# EAGLE design main (EAGLE 7.3.0)
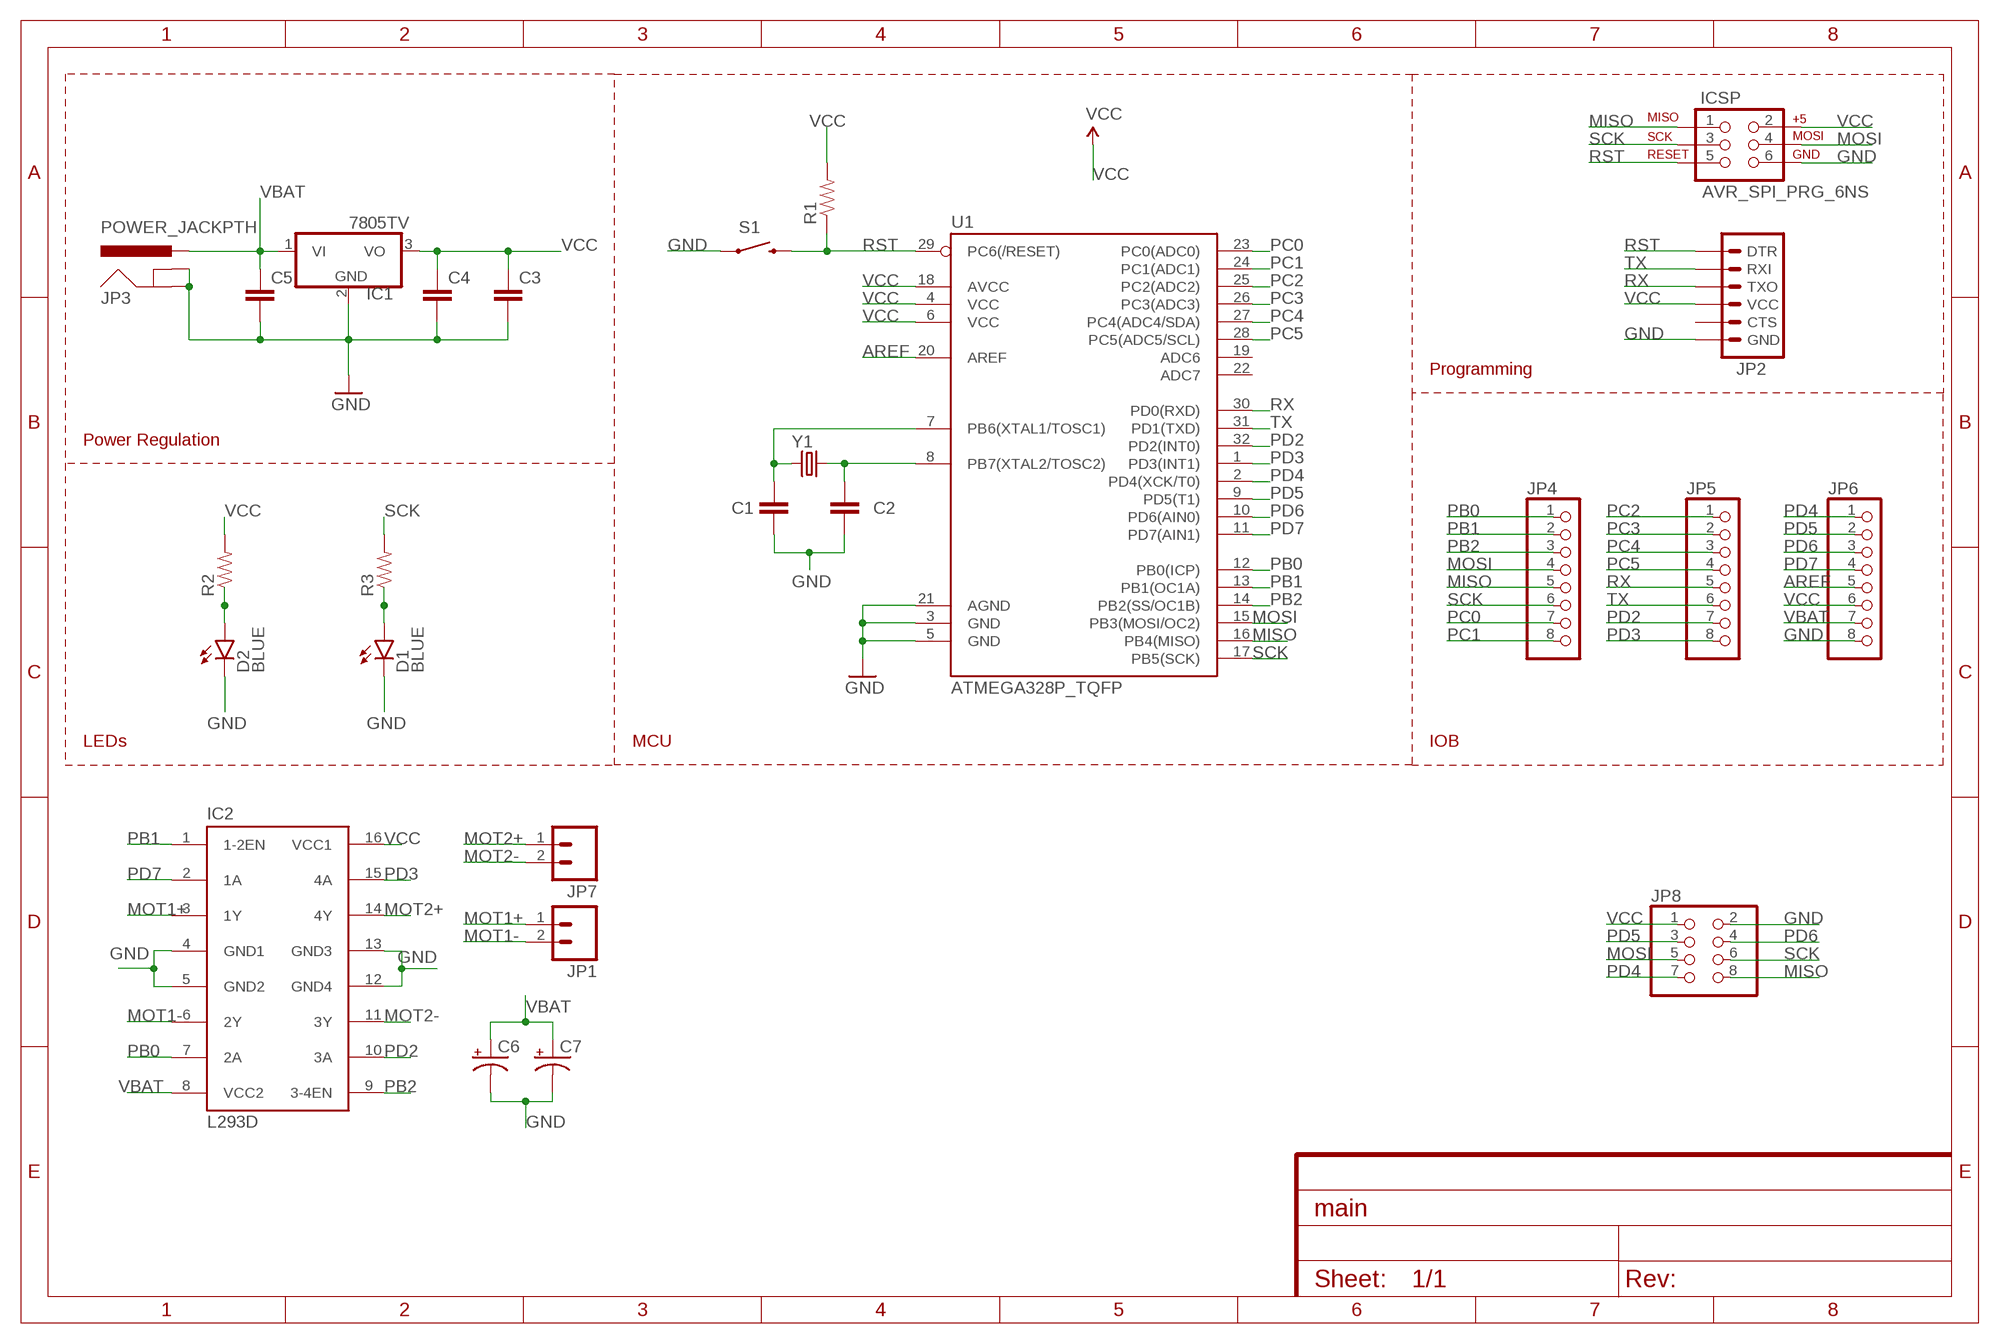
[diagram p0: schematic, sheet 1]

## Parts
C1  CAP0805  [0805]
C2  CAP0805  [0805]
C3  CAP0805  [0805]
C4  CAP0805  [0805]
C5  CAP0805  [0805]
C6  CAP_POLPTH2  [CPOL-RADIAL-10UF-25V]
C7  CAP_POLPTH2  [CPOL-RADIAL-10UF-25V]
D1  BLUE  LED-BLUE0603  [LED-0603]
D2  BLUE  LED-BLUE0603  [LED-0603]
IC1  7805TV  [TO220V]
IC2  L293D  [DIL16]
ICSP  AVR_SPI_PRG_6NS  [2X3-NS]
JP1  M025MM  [SCREWTERMINAL-5MM-2]
JP2  ARDUINO_SERIAL_PROGRAMLOCK  [1X06_LOCK]
JP3  POWER_JACKPTH  [POWER_JACK_PTH]
JP4  PINHD-1X8  [1X08]
JP5  PINHD-1X8  [1X08]
JP6  PINHD-1X8  [1X08]
JP7  M025MM  [SCREWTERMINAL-5MM-2]
JP8  PINHD-2X4  [2X04]
R1  RESISTOR0805-RES  [0805]
R2  RESISTOR0805-RES  [0805]
R3  RESISTOR0805-RES  [0805]
S1  SWITCH-MOMENTARY-2SMD  [TACTILE-SWITCH-SMD]
U1  ATMEGA328P_TQFP  [TQFP32-08]
Y1  CRYSTALHC49US  [HC49US]

## Nets
AREF: JP6.5 U1.20(AREF)
GND [GND]: C1.2 C2.2 C3.2 C4.2 C5.2 C6.2(-) C7.2(-) D1.C D2.C IC1.2(GND) IC2.4(GND1) IC2.5(GND2) IC2.12(GND4) IC2.13(GND3) ICSP.6 JP2.6(GND) JP3.GND JP3.GNDBREAK JP6.8 JP8.2 S1.1 U1.3(GND) U1.5(GND) U1.21(AGND)
MISO: ICSP.1 JP4.5 JP8.8 U1.16(PB4(MISO))
MOSI: ICSP.4 JP4.4 JP8.5 U1.15(PB3(MOSI/OC2))
MOT1+: IC2.3(1Y) JP1.1
MOT1-: IC2.6(2Y) JP1.2
MOT2+: IC2.14(4Y) JP7.1
MOT2-: IC2.11(3Y) JP7.2
N$1: C1.1 U1.7(PB6(XTAL1/TOSC1)) Y1.2
N$2: C2.1 U1.8(PB7(XTAL2/TOSC2)) Y1.1
N$3: D2.A R2.1
N$4: D1.A R3.1
PB0: IC2.7(2A) JP4.1 U1.12(PB0(ICP))
PB1: IC2.1(1-2EN) JP4.2 U1.13(PB1(OC1A))
PB2: IC2.9(3-4EN) JP4.3 U1.14(PB2(SS/OC1B))
PC0: JP4.7 U1.23(PC0(ADC0))
PC1: JP4.8 U1.24(PC1(ADC1))
PC2: JP5.1 U1.25(PC2(ADC2))
PC3: JP5.2 U1.26(PC3(ADC3))
PC4: JP5.3 U1.27(PC4(ADC4/SDA))
PC5: JP5.4 U1.28(PC5(ADC5/SCL))
PD2: IC2.10(3A) JP5.7 U1.32(PD2(INT0))
PD3: IC2.15(4A) JP5.8 U1.1(PD3(INT1))
PD4: JP6.1 JP8.7 U1.2(PD4(XCK/T0))
PD5: JP6.2 JP8.3 U1.9(PD5(T1))
PD6: JP6.3 JP8.4 U1.10(PD6(AIN0))
PD7: IC2.2(1A) JP6.4 U1.11(PD7(AIN1))
RST: ICSP.5 JP2.1(DTR) R1.1 S1.3 U1.29(PC6(/RESET))
RX: JP2.3(TXO) JP5.5 U1.30(PD0(RXD))
SCK: ICSP.3 JP4.6 JP8.6 R3.2 U1.17(PB5(SCK))
TX: JP2.2(RXI) JP5.6 U1.31(PD1(TXD))
VBAT [VBAT]: C5.1 C6.1(+) C7.1(+) IC1.1(VI) IC2.8(VCC2) JP3.PWR JP6.7
VCC [VCC]: C3.1 C4.1 IC1.3(VO) IC2.16(VCC1) ICSP.2 JP2.4(VCC) JP6.6 JP8.1 R1.2 R2.2 U1.4(VCC) U1.6(VCC) U1.18(AVCC)
Unconnected: JP2.5(CTS) U1.19(ADC6) U1.22(ADC7)

## Notes on the sheet
- Programming
- Power Regulation
- LEDs | MCU | IOB

## Library data of the parts
C1-C5 = SparkFun-Passives:CAP: Capacitor Standard 0603 ceramic capacitor, and 0.1" leaded capacitor.
C6 C7 = SparkFun-Passives:CAP_POL: Capacitor Polarized These are standard SMD and PTH capacitors. Normally 10uF, 47uF, and 100uF in electrolytic and tantalum varieties. Always verify the external diameter of the through hole cap, it varies with capacity, voltage, and manufacturer. The EIA devices should be standard.
D1 D2 = SparkFun-LED:LED-BLUE: Blue LEDs for production use Various blue LEDs stocked by SparkFun production 0603 - DIO-08575 Rebel - DIO-09553 1206 - DIO-09911; PROD_ID: DIO-08575
IC1 = linear:78*: Positive VOLTAGE REGULATOR Source: http://cache.national.com/ds/LM/LM78L05.pdf http://www.fairchildsemi.com/ds/LM/LM7805.pdf
IC2 = st-microelectronics:L293D: PUSH-PULL 4 CHANNEL DRIVER; MPN: L293D; OC_FARNELL: 9589619; OC_NEWARK: 56P8249
ICSP = SparkFun-Connectors:AVR_SPI_PRG_6: AVR ISP 6 Pin This is the reduced ISP connector for AVR programming. Common on Arduino. This footprint will take up less PCB space and can be used with a 10-pin to 6-pin adapter such as SKU: BOB-08508 **Special note about "TEST_POINT" package. The stop mask is on the top side, so if you want your programming test points to be on the bottom of your board, make sure to place this package on the bottom side of the board. This also ensure that the orientation to program from the bottom side will be correct.
JP1 JP7 = SparkFun-Connectors:M02: Standard 2-pin 0.1" header. Use with - straight break away headers ( PRT-00116) - right angle break away headers (PRT-00553) - swiss pins (PRT-00743) - machine pins (PRT-00117) - female headers (PRT-00115) Molex polarized connector foot print use with: PRT-08233 with associated crimp pins and housings. 2.54_SCREWTERM for use with PRT-10571. 3.5mm Screw Terminal footprints for PRT-08084 5mm Screw Terminal footprints for use with PRT-08432; STOREFRONT_ID: PRT-08432
JP2 = SparkFun-Connectors:ARDUINO_SERIAL_PROGRAM: FTDI connector footprints
JP3 = SparkFun-Connectors:POWER_JACK: Power Jack This is the standard 5.5mm barrel jack for power. The PTH is the most common, proven, reliable, footprint. The Slot footprint only works if the mill layer is transmitted to the PCB fab house so be warned. Mating wall wart : TOL-00298 (and others); PROD_ID: CONN-08197
JP4-JP6 = pinhead:PINHD-1X8: PIN HEADER
JP8 = pinhead:PINHD-2X4: PIN HEADER
R1-R3 = SparkFun-Resistors:RESISTOR: Resistor Basic schematic elements and footprints for 0603, 1206, and PTH resistors.
S1 = SparkFun-Electromechanical:SWITCH-MOMENTARY-2: Various NO switches- pushbuttons, reed, etc; PROD_ID: SWCH-08247
U1 = SparkFun-DigitalIC:ATMEGA328P_TQFP; PROD_ID: IC-09069
Y1 = SparkFun-FreqCtrl:CRYSTAL: Various standard crystals. Proven footprints.

## Net classes
1 GND: width 0.254 mm
2 VBAT: width 0.254 mm
3 VCC: width 0.254 mm

## Board
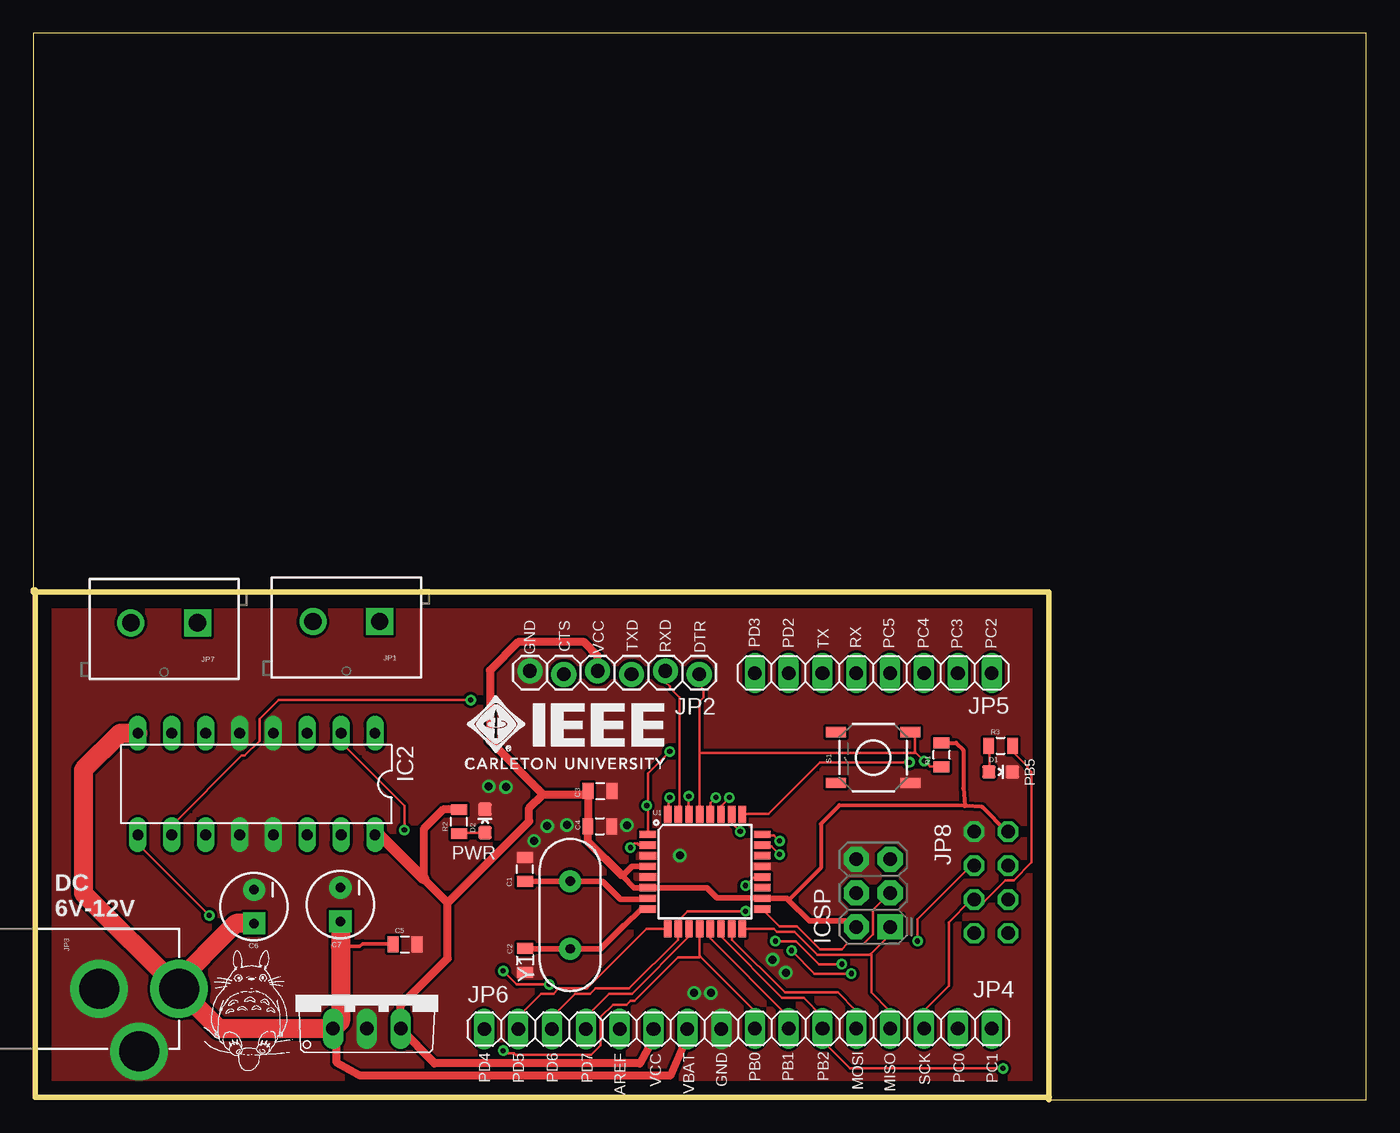
[diagram p1: board, top side]
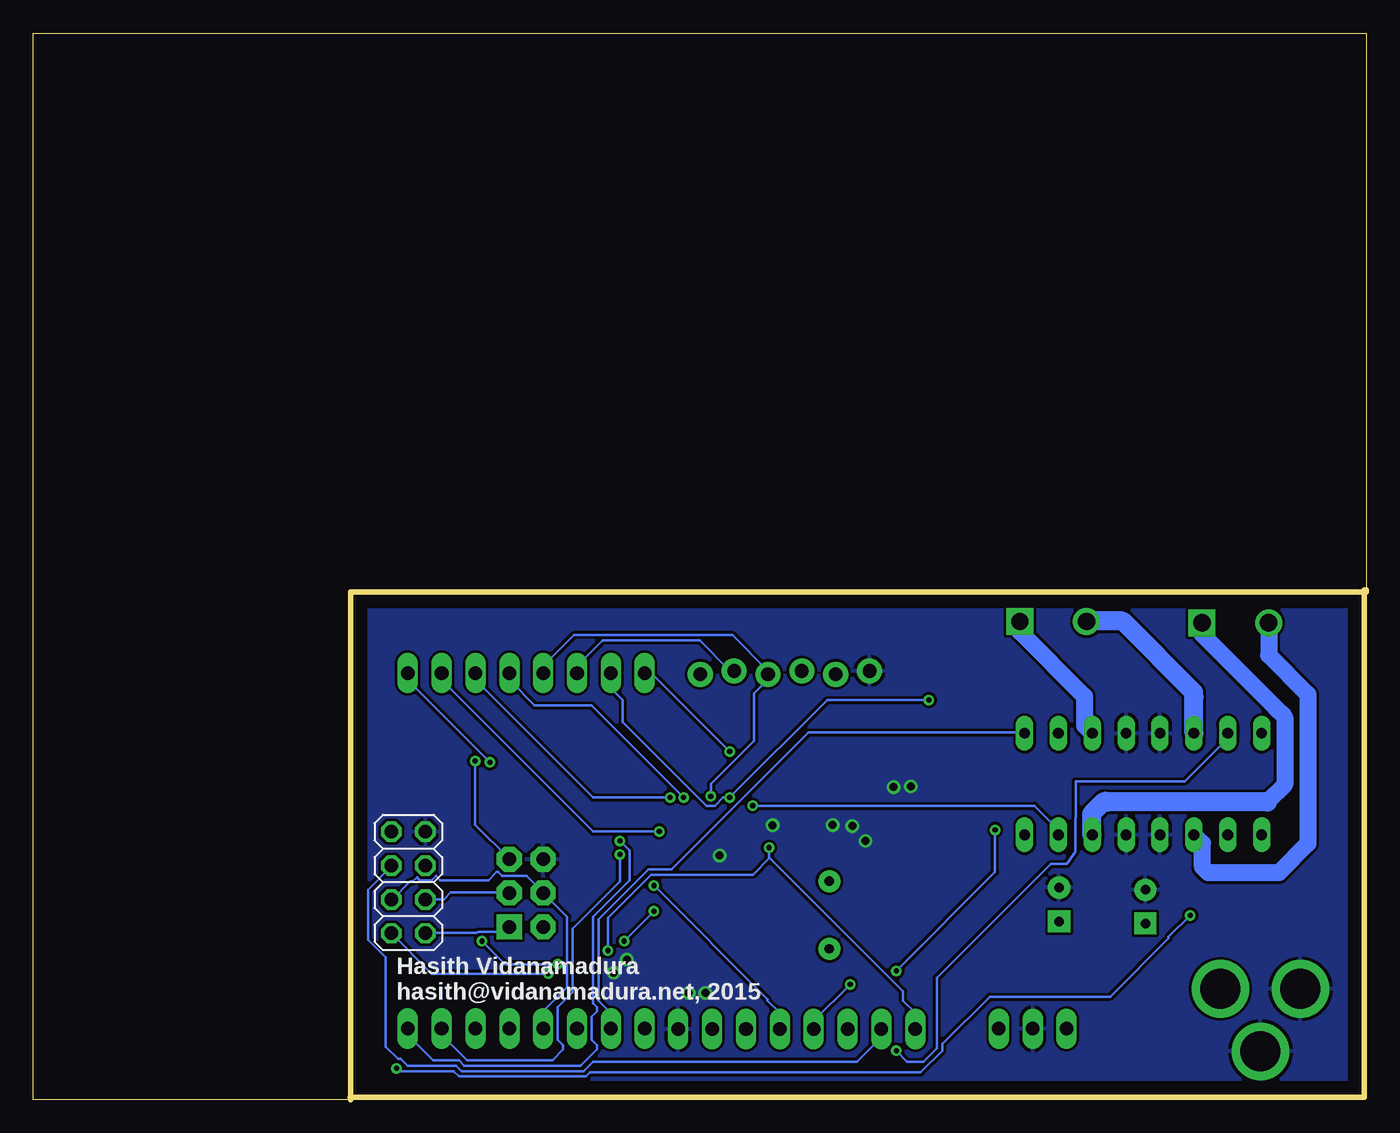
[diagram p2: board, bottom side, seen from below]

Size 100 x 80 mm. Coordinates in mm from the lower left corner, seen from the top.
Outline: 0,38.23 0,80 100,80 100,0 76.2,0 76.2,38.1 0,38.1 0,38.23
Outline: 0,38.23 0.15,38.23 0.15,0.15 76.22,0.15
Copper layers (1*16): Top 0.035mm / dielectric 1.5mm / Bottom 0.035mm
Design rules "default *": minimum track width 8mil, minimum drill 15mil, track to track 8mil, track to pad 8mil, pad to pad 8mil, via to via 8mil, smd to smd 8mil, copper to edge 40mil, drill to drill 15mil, minimum pad ring 10mil, minimum via ring 8mil, stop-mask expansion 4mil, vias tented up to drill 25mil, thermal gap 10mil

### Footprints (pad centres in the part's own frame; a part is rotated, then mirrored left to right if it is on the bottom)
0805 = smd 0.8 x 1.2: 1 -0.9,0; 2 0.9,0
CPOL-RADIAL-10UF-25V = drill 0.7 pad 1.651 square: 1 1.27,0 | drill 0.7 pad 1.651: 2 -1.27,0
LED-0603 = smd 1 x 1: A 0,-0.877; C 0,0.877
TO220V = drill 1.016 long: 1 -2.54,-2.54; 2 0,-2.54; 3 2.54,-2.54
DIL16 = drill 0.813 long: 1 -8.89,-3.81; 2 -6.35,-3.81; 3 -3.81,-3.81; 4 -1.27,-3.81; 5 1.27,-3.81; 6 3.81,-3.81; 7 6.35,-3.81; 8 8.89,-3.81; 9 8.89,3.81; 10 6.35,3.81; 11 3.81,3.81; 12 1.27,3.81; 13 -1.27,3.81; 14 -3.81,3.81; 15 -6.35,3.81; 16 -8.89,3.81
2X3-NS = drill 1.016 pad 1.88 square: 1 -2.54,-1.27 | drill 1.016 pad 1.88 octagon: 2 -2.54,1.27; 3 0,-1.27; 4 0,1.27; 5 2.54,-1.27; 6 2.54,1.27
SCREWTERMINAL-5MM-2 = drill 1.3 pad 2.032 square: 1 0,0 | drill 1.3 pad 2.032: 2 5,0
1X06_LOCK = drill 1.016 pad 1.88: 1 0,0; 2 2.54,-0.254; 3 5.08,0; 4 7.62,-0.254; 5 10.16,0; 6 12.7,-0.254
POWER_JACK_PTH = drill 2.997 pad 4.318: GND 0,7.7; GNDBREAK 4.7,10.7; PWR 0,13.7
1X08 = drill 1.016 long: 1 -8.89,0; 2 -6.35,0; 3 -3.81,0; 4 -1.27,0; 5 1.27,0; 6 3.81,0; 7 6.35,0; 8 8.89,0
2X04 = drill 1.016 octagon: 1 -3.81,-1.27; 2 -3.81,1.27; 3 -1.27,-1.27; 4 -1.27,1.27; 5 1.27,-1.27; 6 1.27,1.27; 7 3.81,-1.27; 8 3.81,1.27
TACTILE-SWITCH-SMD = smd 1.524 x 0.762: 1 -2.794,1.905; 2 2.794,1.905; 3 -2.794,-1.905; 4 2.794,-1.905
TQFP32-08 = smd 1.27 x 0.559: 1 -4.293,2.8; 2 -4.293,2; 3 -4.293,1.2; 4 -4.293,0.4; 5 -4.293,-0.4; 6 -4.293,-1.2; 7 -4.293,-2; 8 -4.293,-2.8; 17 4.293,-2.8; 18 4.293,-2; 19 4.293,-1.2; 20 4.293,-0.4; 21 4.293,0.4; 22 4.293,1.2; 23 4.293,2; 24 4.293,2.8 | smd 0.559 x 1.27: 9 -2.8,-4.293; 10 -2,-4.293; 11 -1.2,-4.293; 12 -0.4,-4.293; 13 0.4,-4.293; 14 1.2,-4.293; 15 2,-4.293; 16 2.8,-4.293; 25 2.8,4.293; 26 2,4.293; 27 1.2,4.293; 28 0.4,4.293; 29 -0.4,4.293; 30 -1.2,4.293; 31 -2,4.293; 32 -2.8,4.293
HC49US = drill 0.7 pad 1.651: 1 -2.54,0; 2 2.54,0

### Placement (x,y rotation side)
C1  36.88,17.27 90 top
C2  36.88,10.44 270 top
C3  42.52,23.14 0 top
C4  42.49,20.5 0 top
C5  27.89,11.63 0 top
C6  16.56,14.48 270 top
C7  23.04,14.63 270 top
D1  72.57,24.59 270 top
D2  33.88,20.9 0 top
IC1  25.02,7.85 0 top
IC2  16.74,23.67 180 top
ICSP  63.02,15.49 90 top
JP1  25.98,35.86 180 top
JP2  49.96,31.9 180 top
JP3  -2.77,8.31 270 top
JP4  63.02,5.33 0 top
JP5  63.02,32 180 top
JP6  42.72,5.28 0 top
JP7  12.32,35.76 180 top
JP8  71.86,16.28 270 bottom
R1  68.15,25.86 90 top
R2  31.93,20.85 90 top
R3  72.57,26.54 0 top
S1  63.02,25.65 180 top
U1  50.39,17.09 0 top
Y1  40.28,13.84 90 top

### Tracks (layer width: path | path; a pad name or v marks a point on that pad's centre or on a via)
AREF  (via drill 0.38)
  Top 0.203: v53.44,16.05 54.05,16.66 54.66,16.66 U1.20
  Bottom 0.203: v53.44,16.05 44.91,7.52 44.91,7.42 43.99,6.5 JP6.5
GND  (via drill 0.6)
  other vias: 56.46,9.53 55.47,10.49 50.83,8 49.58,8 38.56,20.52 37.57,19.41 40.03,20.6 34.16,23.5 35.46,23.44 44.53,20.59 48.51,18.31
  pour Top (rank 2, no thermals): 1.35,36.98 75.41,36.98 75.41,1.24 1.02,1.24 1.02,36.91
  pour Bottom: 2.13,37.16 75.34,37.16 75.34,1.5 1.09,1.5 1.17,35.41 1.09,36.78 1.12,37.13
MISO
  Top 0.203: U1.16 55.58,12.8 55.78,12.6 57.1,12.6 58.83,10.87 62.79,10.87 62.84,10.92 | 62.84,10.92 64.21,12.29 64.21,12.9 ICSP.1 | JP4.5 64.21,5.38 64.21,6.71 62.89,8.03 62.89,10.87 62.84,10.92
  Bottom 0.203: JP8.8 70.51,12.5 66.75,12.5 66.65,12.6 64.62,12.6 64.31,12.9 ICSP.1
MOSI
  Top 0.203: U1.15 52.43,12.8 52.43,11.99 56.39,8.03 60.35,8.03 61.67,6.71 61.67,5.38 JP4.4
  Bottom 0.203: JP8.5 73.05,15.04 71.73,16.36 71.53,16.36 71.22,16.66 71.02,16.46 70.1,16.46 69.8,16.76 69.49,16.46 65.84,16.46 65.23,17.07 65.13,17.07 64.82,16.76 62.99,16.76 61.77,15.54 ICSP.4 61.67,15.44 59.94,13.72 59.94,8.43 61.67,6.71 61.67,5.38 JP4.4
MOT1+
  Bottom 1.27: JP1.1 25.98,35.1 21.13,30.25 21.13,28.07 IC2.3
MOT1-
  Bottom 1.422: IC2.6 12.93,30.17 12.94,30.18 12.94,30.56 18.27,35.89 20.96,35.89 JP1.2
MOT2+
  Bottom 1.27: JP7.1 12.32,34.92 6.88,29.49 6.88,29.46 6.12,28.7 6.12,23.62 7.42,22.33
  Bottom 1.422: 7.42,22.33 19.42,22.33 19.46,22.37 19.67,22.37 20.61,21.43 20.61,19.92 IC2.14
MOT2-
  Bottom 1.27: JP7.2 7.32,33.35 4.37,30.4 4.37,19.2 6.55,17.02 11.86,17.02 12.29,17.45 12.29,19.23 IC2.11
N$1
  Top 0.406: U1.7 46.04,15.04 44.04,15.04 42.7,16.38 Y1.2 36.89,16.38 C1.1
N$2
  Top 0.406: U1.8 46.06,14.25 45.54,14.25 44.37,13.08 44.32,13.08 42.55,11.3 Y1.1 36.92,11.3 C2.1
N$3
  Top 0.203: D2.A 33.83,20.02 32,20.02 R2.1
N$4
  Top 0.203: D1.A 71.73,24.59 71.73,26.52 R3.1
PB0  (via drill 0.38)
  Top 0.203: 50.04,10.72 54.05,6.71 54.05,5.38 JP4.1 | 50.04,10.72 49.99,10.77 U1.12 | v35.26,3.66 35.46,3.45 36.07,3.45 36.17,3.35 41.86,3.35 42.57,4.06 42.57,6.2 43.48,7.11 44.5,7.11 44.81,7.42 45.11,7.42 48.36,10.67 49.99,10.67 50.04,10.72
  Bottom 0.203: v35.26,3.66 34.44,2.85 33.22,2.85 32.21,3.86 32.21,9.14 23.67,17.68 22.45,17.68 21.81,18.59 21.81,20.93 21.8,21.29 21.8,23.88 13.61,23.88 10.46,27.03 10.46,27.43 IC2.7
PB1
  Top 0.203: U1.13 50.8,12.09 56.59,6.3 56.59,5.38 JP4.2
  Bottom 0.203: IC2.1 25.7,27.53 41.86,27.53 52.12,17.27 53.85,17.27 57.61,13.51 57.61,7.42 56.69,6.5 56.69,5.38 JP4.2
PB2  (via drill 0.38)
  Top 0.203: U1.14 51.61,12.8 51.61,12.19 56.19,7.62 57.81,7.62 59.13,6.3 59.13,5.38 JP4.3 59.23,5.28 59.23,4.37 61.27,2.34 v72.75,2.34 | v13.21,13.82 7.92,19.1 7.92,19.81 IC2.9
  Bottom 0.203: v13.21,13.82 14.83,12.19 14.83,12.09 19.2,7.72 28.25,7.72 31.8,4.17 31.8,3.66 33.43,2.03 58.22,2.03 58.52,1.73 68.07,1.73 68.48,2.13 72.54,2.13 v72.75,2.34
PC0  (via drill 0.38)
  Top 0.203: v55.98,18.39 55.37,19 54.76,19 U1.23
  Bottom 0.203: v55.98,18.39 55.98,16.36 59.54,12.8 59.54,8.03 60.66,6.91 60.66,4.47 60.25,4.06 60.25,3.76 61.06,2.95 67.46,2.95 69.29,4.78 69.29,5.28 JP4.7
PC1  (via drill 0.38)
  Top 0.203: v55.98,19.41 55.58,19.81 54.76,19.81 U1.24
  Bottom 0.203: v55.98,19.41 55.27,18.69 55.27,16.46 58.01,13.72 58.01,7.21 57.71,6.91 57.71,6.6 58.12,6.2 58.12,4.47 57.71,4.06 57.71,3.76 58.93,2.54 67.67,2.54 68.07,2.95 70,2.95 71.83,4.78 71.83,5.28 JP4.8
PC2  (via drill 0.38)
  Top 0.203: v65.73,25.3 59.03,25.3 55.17,21.44 53.24,21.44 U1.25
  Bottom 0.203: v65.73,25.3 71.83,31.39 71.83,32 JP5.1
PC3  (via drill 0.38)
  Top 0.203: v53.03,20.12 52.43,20.73 52.43,21.34 U1.26
  Bottom 0.203: v53.03,20.12 58.01,20.12 69.29,31.39 69.29,32 JP5.2
PC4  (via drill 0.38)
  Top 0.203: v52.22,22.66 51.61,22.05 51.61,21.44 U1.27
  Bottom 0.203: v52.22,22.66 58.01,22.66 66.75,31.39 66.75,32 JP5.3
PC5  (via drill 0.38)
  Top 0.203: v51.21,22.66 50.8,22.25 50.8,21.44 U1.28
  Bottom 0.203: v51.21,22.66 58.12,29.57 62.38,29.57 64.21,31.39 64.21,32 JP5.4
PD2  (via drill 0.38)
  Top 0.203: v47.75,22.66 47.75,22.35 47.65,22.25 47.65,21.44 U1.32 | v32.82,29.97 18.39,29.97 16.97,28.55 16.97,26.92 15.85,25.81 15.65,25.81 10.46,20.62 10.46,19.91 IC2.10
  Bottom 0.203: JP5.7 56.59,32 56.59,30.79 55.78,29.97 55.78,28.35 49.48,22.05 48.87,22.05 48.26,22.66 v47.75,22.66 40.44,29.97 v32.82,29.97
PD3  (via drill 0.38)
  Top 0.203: 46.13,22.05 46.13,24.49 v47.75,26.11 | 46.13,22.05 46.13,19.91 U1.1 | 46.13,22.05 v46.02,22.05
  Bottom 0.203: v47.75,26.11 53.65,32 JP5.8 | v46.02,22.05 24.89,22.05 23.16,20.32 23.16,19.91 IC2.15
PD4  (via drill 0.38)
  Top 0.203: v44.81,18.9 45.11,19.2 45.31,19.2 45.41,19.1 46.02,19.1 U1.2 | v61.37,9.45 58.62,9.45 v56.9,11.18
  Bottom 0.203: v44.81,18.9 44.81,18.19 44.76,18.14 | 44.76,18.14 34.75,8.13 34.75,7.42 33.83,6.5 JP6.1 | JP8.7 70.1,9.45 v61.37,9.45 | v56.9,11.18 56.9,13.61 53.65,16.87 46.02,16.87 44.76,18.14
PD5
  Top 0.203: U1.9 46.02,12.8 41.55,8.33 39.42,8.33 39.01,7.92 38.1,7.92 36.37,6.2 JP6.2
  Bottom 0.203: JP6.2 36.37,4.67 38.2,2.85 58.01,2.85 58.73,2.13 67.87,2.13 68.28,2.54 71.93,2.54 72.44,3.05 72.64,3.05 73.56,3.96 73.56,10.67 74.88,11.99 74.88,15.75 73.15,17.48 JP8.3
PD6  (via drill 0.38)
  Top 0.203: JP6.3 38.91,6.2 40.64,7.92 41.76,7.92 42.16,8.33 44.7,8.33 48.36,11.99 48.36,12.8 U1.10 48.46,12.8 48.46,13.51 49.07,14.12 v53.44,14.12 | v66.34,11.89 66.34,13.51 70.31,17.48 70.51,17.48 JP8.4 | v60.66,10.16 58.93,10.16 57.2,11.89 v55.68,11.89
  Bottom 0.203: v66.34,11.89 64.62,10.16 v60.66,10.16 | v53.44,14.12 v55.68,11.89
PD7  (via drill 0.38)
  Top 0.203: JP6.4 41.45,6.2 43.18,7.92 44.91,7.92 49.17,12.19 49.17,12.8 U1.11 | v27.84,20.22 27.84,22.05 23.16,26.72 23.16,27.43 IC2.2 | v35.26,9.65 36.27,8.64 v38.71,8.64
  Bottom 0.203: v27.84,20.22 27.84,17.07 v35.26,9.65 | v38.71,8.64 41.45,5.89 JP6.4
RST  (via drill 0.38)
  Top 0.203: 49.99,26.01 49.99,29.87 50.29,30.18 50.29,30.79 49.99,31.09 49.99,31.9 JP2.1 | 49.99,26.01 49.99,21.44 U1.29 | 66.19,26.06 66.14,26.11 66.14,27.23 S1.3 | 66.19,26.06 v66.85,25.4 67.26,24.99 68.07,24.99 R1.1 | 49.99,26.01 66.14,26.01 66.19,26.06
  Bottom 0.203: v66.85,25.4 66.85,20.62 64.31,18.09 ICSP.5
RX  (via drill 0.38)
  Top 0.203: v49.17,22.76 49.17,21.44 U1.30
  Bottom 0.203: v49.17,22.76 49.17,23.67 45.92,26.92 45.92,30.48 44.91,31.5 44.91,31.9 | 44.91,31.9 44.91,32.21 47.55,34.85 59.44,34.85 61.67,32.61 61.67,32 JP5.5 | 44.91,31.9 JP2.3
SCK
  Top 0.203: U1.17 54.76,14.22 55.98,13.01 57.3,13.01 59.03,11.28 60.66,11.28 61.06,11.68 62.28,11.68 62.99,12.39 62.99,14.22 64.21,15.44 ICSP.3 | R3.2 73.56,26.52 73.56,26.01 74.57,24.99 74.57,24.89 74.88,24.59 74.88,17.78 73.56,16.46 72.95,16.46 71.32,14.83 70.71,14.83 70.61,14.94 JP8.6 70.51,14.94 70.31,14.94 68.68,13.31 68.68,8.53 66.85,6.71 66.85,5.38 JP4.6
  Bottom 0.203: ICSP.3 64.31,15.54 68.68,15.54 69.19,15.04 70.51,15.04 JP8.6
TX
  Top 0.203: U1.31 48.46,21.44 48.46,30.18 47.75,30.89 47.75,30.99 47.45,31.29 47.45,32.11 JP2.2
  Bottom 0.203: JP5.6 59.13,32 59.13,32.61 57.3,34.44 49.99,34.44 47.75,32.21 47.45,32.21 JP2.2
VBAT
  Top 0.254: 23.04,11.48 24.49,11.48 24.69,11.68 26.92,11.68 C5.1
  Top 0.61: JP6.7 48.79,5 48.79,3.99 47.83,1.83 24.43,1.83 22.76,2.77 22.76,5.03 IC1.1
  Top 1.422: IC2.8 6.53,27.48 3.76,24.71 3.76,15.48 JP3.PWR | JP3.PWR 13.93,5.31 IC1.1 23.04,5.87 23.04,11.48 C7.1 | C6.1 15.19,13.21 10.41,8.43 10.8,8.43 JP3.PWR
VCC
  Top 0.305: JP8.1 73.05,20.09 71.2,21.95 69.88,22.02 | 69.88,22.02 60.48,22.07 59.08,20.68 59.08,17.37 56.67,14.96 | R1.2 69.23,26.76 69.77,26.21 69.77,23.37 69.88,22.02
  Top 0.406: ICSP.2 61.29,13.41 58.22,13.41 56.67,14.96 56.53,15.09 U1.18 54.64,15.14 51.31,15.14 50.55,15.89 U1.6 45.07,15.89 44.2,16.76 | 44.2,16.76 44.12,16.84 | U1.4 44.93,17.49 44.2,16.76
  Top 0.61: 31.09,14.76 31.09,10.59 27.56,7.06 IC1.3 30.1,2.72 45.52,2.72 46.53,4.55 JP6.6 | 31.09,14.76 37.21,20.88 37.21,21.87 38.25,22.91 | 38.25,22.91 41.39,22.91 C3.1 41.62,20.52 C4.1 41.59,19.37 44.12,16.84 | R2.2 30.75,21.75 | 30.75,21.75 29.29,20.3 29.29,16.56 31.09,14.76 | JP2.4 42.34,33.3 41.33,34.31 36.37,34.31 34.27,32.21 34.27,26.9 38.25,22.91 | 30.76,21.77 30.75,21.75
  Top 0.813: IC2.16 25.98,19.86 29.29,16.56

### Text on the board
tPlace: GND | CTS | VCC | TXD | RXD | DTR | PD3 | PD2 | TX | RX | PC5 | PC4 | PC3 | PC2 | PB5 | PWR | DC / 6V-12V | PD4 | PD6 | VBAT | GND | PB0 | PB1 | PB2 | MOSI | MISO | SCK | PC0 | PC1 | PD5 | PD7 | AREF | VCC
bPlace: Hasith Vidanamadura / hasith@vidanamadura.net, 2015